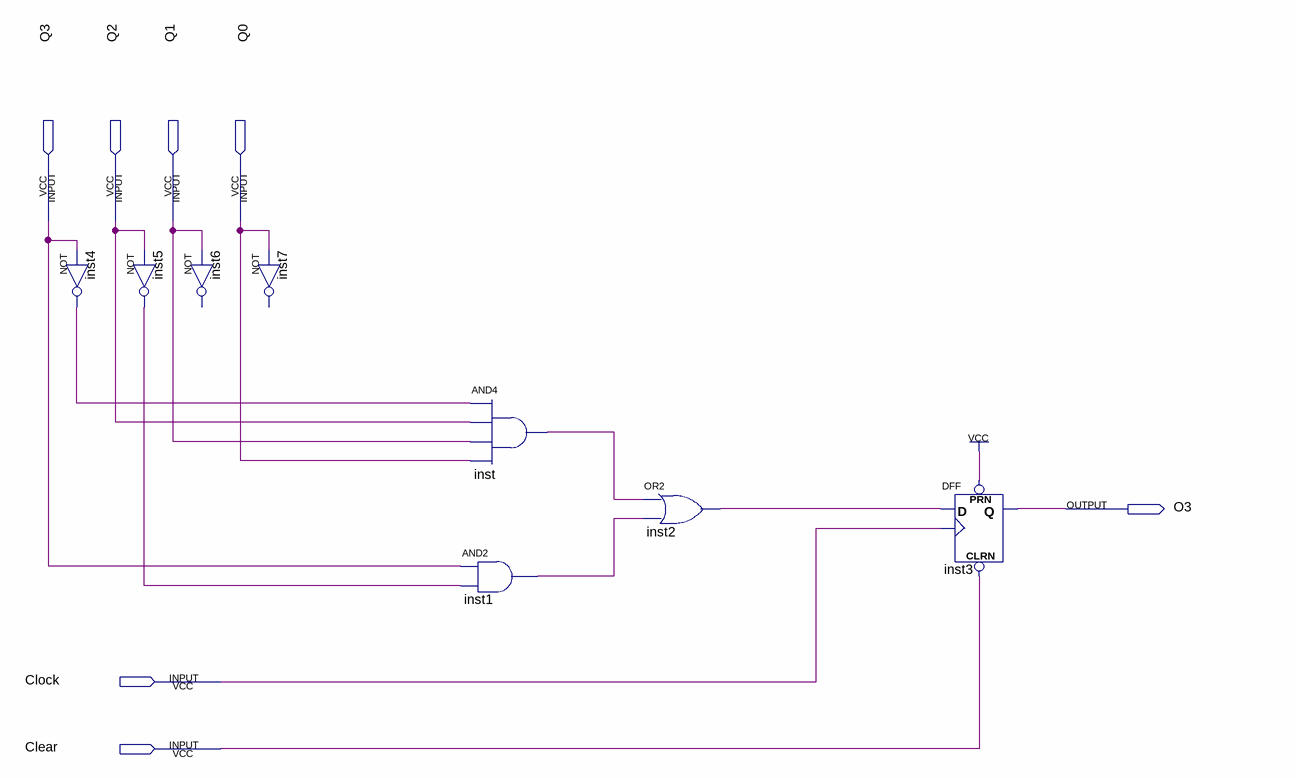
[diagram p0: schematic sheet]
// Quartus schematic 0CD3.bdf as structural Verilog: 8 symbols, 7 pins
module \0CD3  (
  input  Q3,
  input  Q2,
  input  Q1,
  input  Q0,
  input  Clock,
  input  Clear,
  output O3
);

  wire inst1_out, inst2_out, inst4_out, inst5_out, inst_out;

  not inst4 (inst4_out, Q3);
  not inst5 (inst5_out, Q2);
  // NOT inst6 has open pins: IN=Q1, OUT=open
  // NOT inst7 has open pins: IN=Q0, OUT=open
  and inst (inst_out, inst4_out, Q2, Q1, Q0);
  and inst1 (inst1_out, Q3, inst5_out);
  or inst2 (inst2_out, inst_out, inst1_out);
  DFF inst3 (.CLRN(Clear), .CLK(Clock), .D(inst2_out), .PRN(1'b1), .Q(O3));
endmodule
